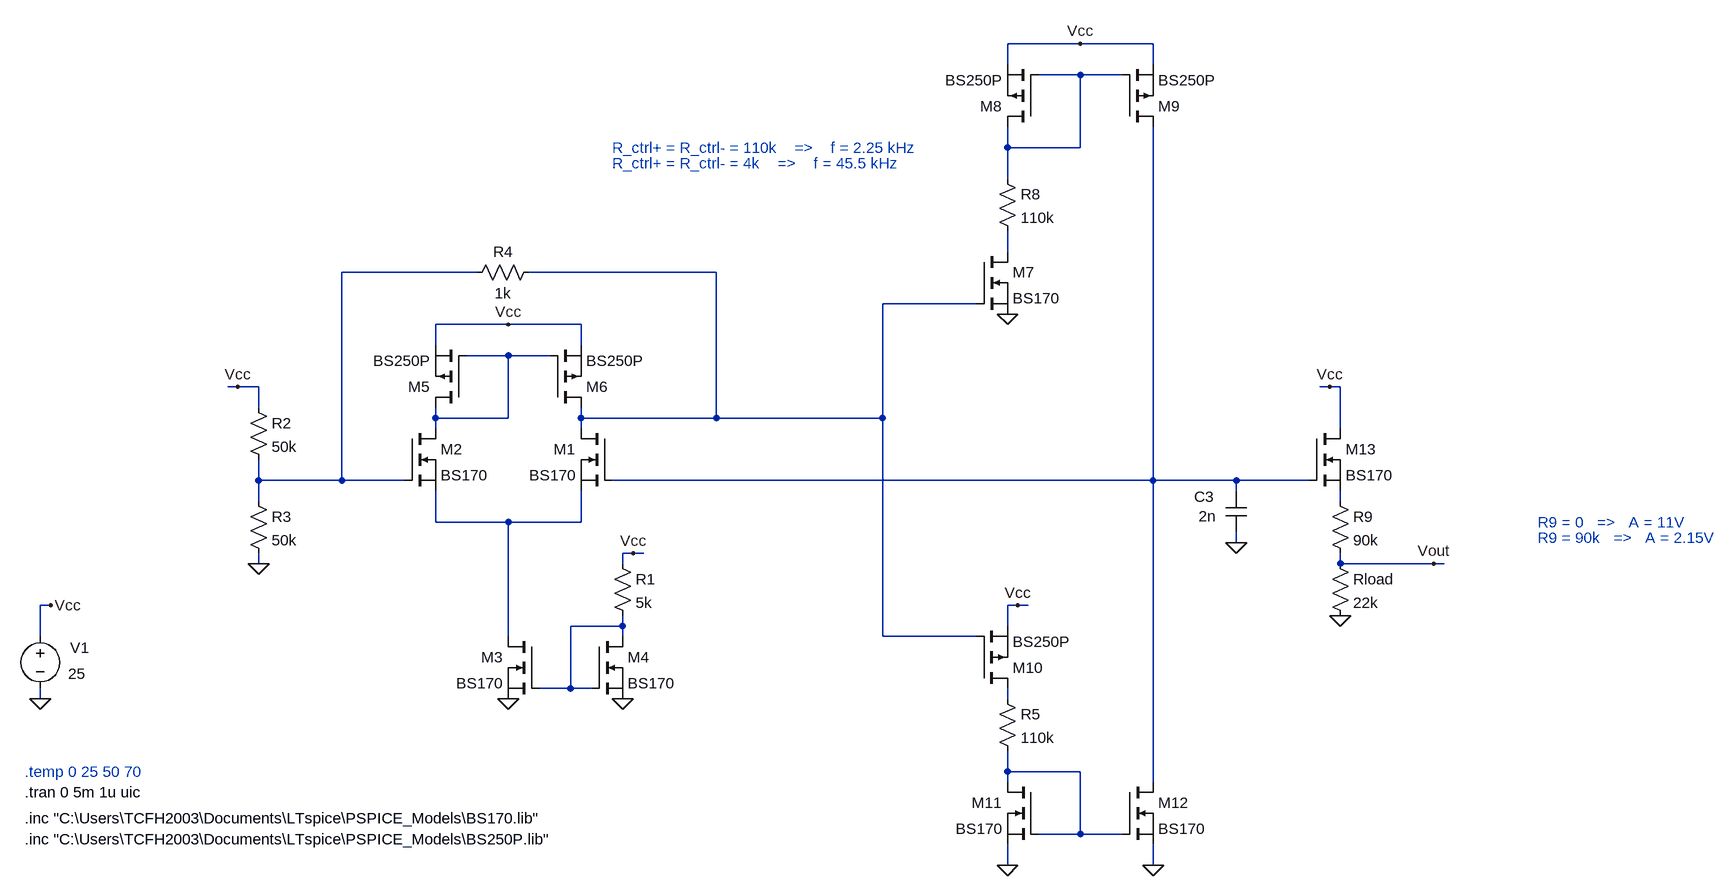
[diagram p0: schematic Proiect1_v4.asc]
Proiect1_v4.asc, the LTspice schematic file:
Version 4
SHEET 1 2096 956
WIRE 1088 -928 976 -928
WIRE 1200 -928 1088 -928
WIRE 976 -896 976 -928
WIRE 1200 -896 1200 -928
WIRE 1088 -880 1024 -880
WIRE 1152 -880 1088 -880
WIRE 976 -768 976 -800
WIRE 1088 -768 1088 -880
WIRE 1088 -768 976 -768
WIRE 976 -720 976 -768
WIRE 976 -608 976 -640
WIRE 160 -576 -48 -576
WIRE 528 -576 240 -576
WIRE 928 -528 784 -528
WIRE 208 -496 96 -496
WIRE 320 -496 208 -496
WIRE 96 -464 96 -496
WIRE 320 -464 320 -496
WIRE 208 -448 144 -448
WIRE 272 -448 208 -448
WIRE -208 -400 -224 -400
WIRE -176 -400 -208 -400
WIRE 1472 -400 1456 -400
WIRE 1488 -400 1472 -400
WIRE -176 -368 -176 -400
WIRE 96 -352 96 -368
WIRE 208 -352 208 -448
WIRE 208 -352 96 -352
WIRE 320 -352 320 -368
WIRE 528 -352 528 -576
WIRE 528 -352 320 -352
WIRE 784 -352 784 -528
WIRE 784 -352 528 -352
WIRE 96 -336 96 -352
WIRE 320 -336 320 -352
WIRE 1488 -336 1488 -400
WIRE -176 -256 -176 -288
WIRE -48 -256 -48 -576
WIRE -48 -256 -176 -256
WIRE 48 -256 -48 -256
WIRE 1200 -256 1200 -800
WIRE 1200 -256 368 -256
WIRE 1328 -256 1200 -256
WIRE 1440 -256 1328 -256
WIRE 1328 -240 1328 -256
WIRE -176 -224 -176 -256
WIRE 1488 -224 1488 -240
WIRE 96 -192 96 -240
WIRE 208 -192 96 -192
WIRE 320 -192 320 -240
WIRE 320 -192 208 -192
WIRE 1328 -160 1328 -176
WIRE 400 -144 384 -144
WIRE 416 -144 400 -144
WIRE -176 -128 -176 -144
WIRE 384 -128 384 -144
WIRE 1488 -128 1488 -144
WIRE 1632 -128 1488 -128
WIRE 1648 -128 1632 -128
WIRE -496 -64 -512 -64
WIRE 992 -64 976 -64
WIRE 1008 -64 992 -64
WIRE 384 -32 384 -48
WIRE 384 -32 304 -32
WIRE 976 -32 976 -64
WIRE -512 -16 -512 -64
WIRE 208 -16 208 -192
WIRE 384 -16 384 -32
WIRE 784 -16 784 -352
WIRE 928 -16 784 -16
WIRE 304 64 304 -32
WIRE 304 64 256 64
WIRE 336 64 304 64
WIRE -512 80 -512 64
WIRE 976 80 976 64
WIRE 976 192 976 160
WIRE 1088 192 976 192
WIRE 976 208 976 192
WIRE 1200 208 1200 -256
WIRE 1088 288 1088 192
WIRE 1088 288 1024 288
WIRE 1152 288 1088 288
WIRE 976 336 976 304
WIRE 1200 336 1200 304
FLAG -512 80 0
FLAG -496 -64 Vcc
FLAG 976 336 0
FLAG 1200 336 0
FLAG 1328 -160 0
FLAG 1488 -48 0
FLAG 1088 -928 Vcc
FLAG 400 -144 Vcc
FLAG 208 80 0
FLAG 384 80 0
FLAG 208 -496 Vcc
FLAG -176 -128 0
FLAG -208 -400 Vcc
FLAG 976 -512 0
FLAG 992 -64 Vcc
FLAG 1472 -400 Vcc
FLAG 1632 -128 Vout
SYMBOL voltage -512 -32 R0
WINDOW 0 46 33 Left 2
WINDOW 3 43 73 Left 2
WINDOW 123 0 0 Left 0
WINDOW 39 0 0 Left 0
SYMATTR InstName V1
SYMATTR Value 25
SYMBOL res 960 64 R0
SYMATTR InstName R5
SYMATTR Value 110k
SYMBOL cap 1344 -176 R180
WINDOW 0 50 55 Left 2
WINDOW 3 47 25 Left 2
SYMATTR InstName C3
SYMATTR Value 2n
SYMBOL res 1472 -144 R0
SYMATTR InstName Rload
SYMATTR Value 22k
SYMBOL res 960 -736 R0
SYMATTR InstName R8
SYMATTR Value 110k
SYMBOL nmos 368 -336 M0
SYMATTR InstName M1
SYMATTR Value BS170
SYMBOL nmos 48 -336 R0
SYMATTR InstName M2
SYMATTR Value BS170
SYMBOL nmos 256 -16 M0
SYMATTR InstName M3
SYMATTR Value BS170
SYMBOL nmos 336 -16 R0
SYMATTR InstName M4
SYMATTR Value BS170
SYMBOL res 368 -144 R0
SYMATTR InstName R1
SYMATTR Value 5k
SYMBOL pmos 144 -368 R180
SYMATTR InstName M5
SYMATTR Value BS250P
SYMBOL pmos 272 -368 M180
SYMATTR InstName M6
SYMATTR Value BS250P
SYMBOL res -192 -384 R0
SYMATTR InstName R2
SYMATTR Value 50k
SYMBOL res -192 -240 R0
SYMATTR InstName R3
SYMATTR Value 50k
SYMBOL res 256 -592 R90
WINDOW 0 0 56 VBottom 2
WINDOW 3 32 56 VTop 2
SYMATTR InstName R4
SYMATTR Value 1k
SYMBOL nmos 928 -608 R0
SYMATTR InstName M7
SYMATTR Value BS170
SYMBOL pmos 1024 -800 R180
SYMATTR InstName M8
SYMATTR Value BS250P
SYMBOL pmos 1152 -800 M180
SYMATTR InstName M9
SYMATTR Value BS250P
SYMBOL pmos 928 64 M180
SYMATTR InstName M10
SYMATTR Value BS250P
SYMBOL nmos 1024 208 M0
SYMATTR InstName M11
SYMATTR Value BS170
SYMBOL nmos 1152 208 R0
SYMATTR InstName M12
SYMATTR Value BS170
SYMBOL res 1472 -240 R0
SYMATTR InstName R9
SYMATTR Value 90k
SYMBOL nmos 1440 -336 R0
SYMATTR InstName M13
SYMATTR Value BS170
TEXT -536 224 Left 2 !.tran 0 5m 1u uic
TEXT -536 264 Left 2 !.inc "C:\\Users\\TCFH2003\\Documents\\LTspice\\PSPICE_Models\\BS170.lib"
TEXT -536 296 Left 2 !.inc "C:\\Users\\TCFH2003\\Documents\\LTspice\\PSPICE_Models\\BS250P.lib"
TEXT 368 -768 Left 2 ;R_ctrl+ = R_ctrl- = 110k    =>    f = 2.25 kHz
TEXT 368 -744 Left 2 ;R_ctrl+ = R_ctrl- = 4k    =>    f = 45.5 kHz
TEXT 1792 -192 Left 2 ;R9 = 0   =>   A = 11V
TEXT 1792 -168 Left 2 ;R9 = 90k   =>   A = 2.15V
TEXT -536 192 Left 2 ;.temp 0 25 50 70

The netlist it stands for:
* Proiect1_v4.asc
V1 Vcc 0 25
R5 N010 N011 110k
C3 0 N006 2n
Rload Vout 0 22k
R8 N001 N002 110k
M1 N004 N006 N008 N008 BS170
M2 N005 N003 N008 N008 BS170
M3 N008 N009 0 0 BS170
M4 N009 N009 0 0 BS170
R1 Vcc N009 5k
M5 N005 N005 Vcc Vcc BS250P
M6 N004 N005 Vcc Vcc BS250P
R2 Vcc N003 50k
R3 N003 0 50k
R4 N004 N003 1k
M7 N002 N004 0 0 BS170
M8 N001 N001 Vcc Vcc BS250P
M9 N006 N001 Vcc Vcc BS250P
M10 N010 N004 Vcc Vcc BS250P
M11 N011 N011 0 0 BS170
M12 N006 N011 0 0 BS170
R9 N007 Vout 90k
M13 Vcc N006 N007 N007 BS170
.model NMOS NMOS
.model PMOS PMOS
.lib standard.mos
.tran 0 5m 1u uic
.inc "C:\Users\TCFH2003\Documents\LTspice\PSPICE_Models\BS170.lib"
.inc "C:\Users\TCFH2003\Documents\LTspice\PSPICE_Models\BS250P.lib"
* R_ctrl+ = R_ctrl- = 110k    =>    f = 2.25 kHz
* R_ctrl+ = R_ctrl- = 4k    =>    f = 45.5 kHz
* R9 = 0   =>   A = 11V
* R9 = 90k   =>   A = 2.15V
* .temp 0 25 50 70
.backanno
.end